# Altium project obc.PrjPCB
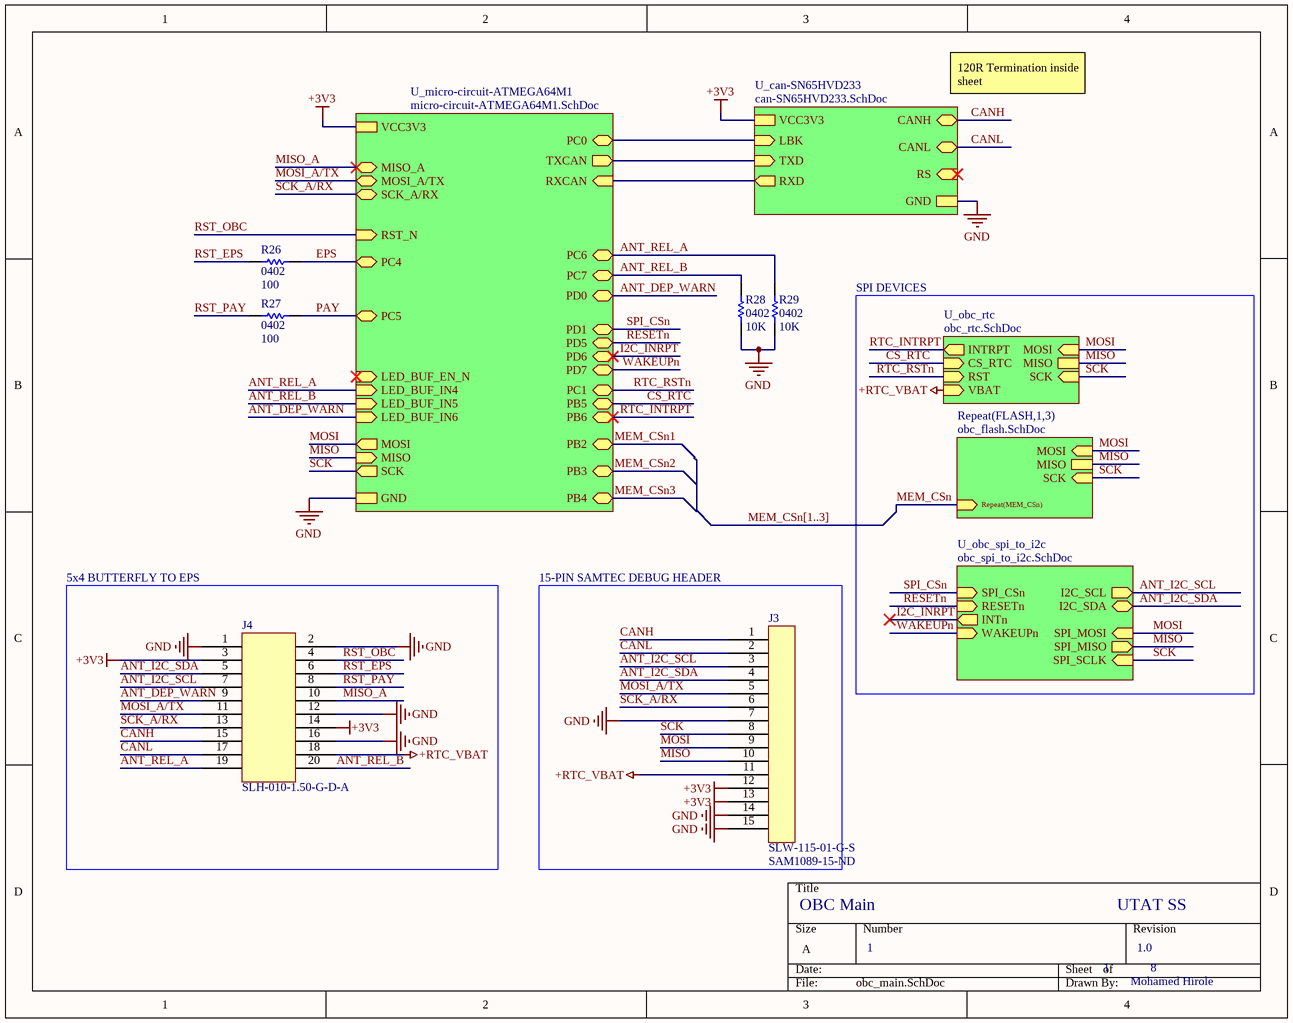
[diagram p0: obc_main.SchDoc]
4 sheets, 30 parts. Net scope: hierarchical (ports join the sheet entries above them; power ports are global).
Board file: obc.PcbDoc
Sheets:
  obc_main.SchDoc
    U_obc_rtc = obc_rtc.SchDoc
    FLASH1 = obc_flash.SchDoc
    FLASH2 = obc_flash.SchDoc
    FLASH3 = obc_flash.SchDoc
    U_obc_spi_to_i2c = obc_spi_to_i2c.SchDoc

## Sheet obc_main.SchDoc: OBC Main
size A; DrawnBy: Mohamed Hirole; Organization: UTAT SS; DocumentNumber: 1; Revision: 1.0; SheetNumber: 1; SheetTotal: 8

### Parts
J3  SLW-115-01-G-S  [SAM1089-15-ND]
J4  SLH-010-1.50-G-D-A  [SLH-010-1.50-G-D-A]
R26  0402  value 100  [RES0402R]
R27  0402  value 100  [RES0402R]
R28  0402  value 10K  [RES0402R]
R29  0402  value 10K  [RES0402R]

### Blocks framed on the sheet
5x4 BUTTERFLY TO EPS: J4
15-PIN SAMTEC DEBUG HEADER: J3

### Sub-sheets
Repeat(FLASH,1,3) = obc_flash.SchDoc: MOSI (in), SCK (in), MISO, Repeat(MEM_CSn) (in)
U_can-SN65HVD233 = can-SN65HVD233.SchDoc (file not in this document): RXD (out), TXD (in), LBK (in), CANL (bidir), CANH (bidir), VCC3V3, GND, RS (in)
U_micro-circuit-ATMEGA64M1 = micro-circuit-ATMEGA64M1.SchDoc (file not in this document): MISO (in), MOSI (out), SCK (out), TXCAN (out), RXCAN (in), MISO_A (bidir), MOSI_A/TX (bidir), SCK_A/RX (bidir), PB2 (bidir), PB3 (bidir), PB4 (bidir), PB5 (bidir), PB6 (bidir), PC0 (bidir), PD0 (bidir), PC1 (bidir), PC4 (bidir), PC5 (bidir), PC6 (bidir), PC7 (bidir), PD1 (bidir), PD5 (bidir), PD6 (bidir), PD7 (bidir), RST_N (in), LED_BUF_EN_N (in), VCC3V3, GND, LED_BUF_IN4 (in), LED_BUF_IN5 (in), LED_BUF_IN6 (in)
U_obc_rtc = obc_rtc.SchDoc: CS_RTC (in), MOSI (in), MISO, SCK (in), INTRPT (out), VBAT (in), RST (in)
U_obc_spi_to_i2c = obc_spi_to_i2c.SchDoc: SPI_MOSI (in), I2C_SDA (bidir), INTn (out), WAKEUPn (in), RESETn (in), SPI_MISO (out), SPI_CSn (in), SPI_SCLK (in), I2C_SCL (out)

### Nets
+3V3: J3.12 J3.13 J4.3 J4.14 ; sheet U_micro-circuit-ATMEGA64M1/VCC3V3, sheet U_can-SN65HVD233/VCC3V3
+RTC_VBAT: J3.11 J4.18 ; sheet U_obc_rtc/VBAT
GND: J3.7 J3.14 J3.15 J4.1 J4.2 J4.12 J4.16 R28.1 R29.1 ; sheet U_micro-circuit-ATMEGA64M1/GND, sheet U_can-SN65HVD233/GND
ANT_DEP_WARN: J4.9 ; sheet U_micro-circuit-ATMEGA64M1/PD0, sheet U_micro-circuit-ATMEGA64M1/LED_BUF_IN6
ANT_I2C_SCL: J3.3 J4.7 ; sheet U_obc_spi_to_i2c/I2C_SCL
ANT_I2C_SDA: J3.4 J4.5 ; sheet U_obc_spi_to_i2c/I2C_SDA
ANT_REL_A: J4.19 R29.2 ; sheet U_micro-circuit-ATMEGA64M1/PC6, sheet U_micro-circuit-ATMEGA64M1/LED_BUF_IN4
ANT_REL_B: J4.20 R28.2 ; sheet U_micro-circuit-ATMEGA64M1/PC7, sheet U_micro-circuit-ATMEGA64M1/LED_BUF_IN5
CANH: J3.1 J4.15 ; sheet U_can-SN65HVD233/CANH
CANL: J3.2 J4.17 ; sheet U_can-SN65HVD233/CANL
CS_RTC: sheet U_obc_rtc/CS_RTC, sheet U_micro-circuit-ATMEGA64M1/PB5
EPS: R26.2 ; sheet U_micro-circuit-ATMEGA64M1/PC4
I2C_INRPT: sheet U_micro-circuit-ATMEGA64M1/PD6, sheet U_obc_spi_to_i2c/INTn
MEM_CSn: sheet Repeat(FLASH,1,3)/Repeat(MEM_CSn)
MISO: J3.10 ; sheet U_obc_rtc/MISO, sheet Repeat(FLASH,1,3)/MISO, sheet U_micro-circuit-ATMEGA64M1/MISO, sheet U_obc_spi_to_i2c/SPI_MISO
MISO_A: J4.10 ; sheet U_micro-circuit-ATMEGA64M1/MISO_A
MOSI: J3.9 ; sheet U_obc_rtc/MOSI, sheet Repeat(FLASH,1,3)/MOSI, sheet U_micro-circuit-ATMEGA64M1/MOSI, sheet U_obc_spi_to_i2c/SPI_MOSI
MOSI_A/TX: J3.5 J4.11 ; sheet U_micro-circuit-ATMEGA64M1/MOSI_A/TX
PAY: R27.2 ; sheet U_micro-circuit-ATMEGA64M1/PC5
RESETn: sheet U_micro-circuit-ATMEGA64M1/PD5, sheet U_obc_spi_to_i2c/RESETn
RST_EPS: J4.6 R26.1
RST_OBC: J4.4 ; sheet U_micro-circuit-ATMEGA64M1/RST_N
RST_PAY: J4.8 R27.1
RTC_INTRPT: sheet U_obc_rtc/INTRPT, sheet U_micro-circuit-ATMEGA64M1/PB6
RTC_RSTn: sheet U_obc_rtc/RST, sheet U_micro-circuit-ATMEGA64M1/PC1
SCK: J3.8 ; sheet U_obc_rtc/SCK, sheet Repeat(FLASH,1,3)/SCK, sheet U_micro-circuit-ATMEGA64M1/SCK, sheet U_obc_spi_to_i2c/SPI_SCLK
SCK_A/RX: J3.6 J4.13 ; sheet U_micro-circuit-ATMEGA64M1/SCK_A/RX
SPI_CSn: sheet U_micro-circuit-ATMEGA64M1/PD1, sheet U_obc_spi_to_i2c/SPI_CSn
WAKEUPn: sheet U_micro-circuit-ATMEGA64M1/PD7, sheet U_obc_spi_to_i2c/WAKEUPn
(unnamed): sheet U_micro-circuit-ATMEGA64M1/TXCAN, sheet U_can-SN65HVD233/TXD
(unnamed): sheet U_micro-circuit-ATMEGA64M1/RXCAN, sheet U_can-SN65HVD233/RXD
(unnamed): sheet U_micro-circuit-ATMEGA64M1/PC0, sheet U_can-SN65HVD233/LBK

### Buses and harness runs
bus MEM_CSn[1..3]

### Notes on the sheet
- 120R Termination inside sheet
- SPI DEVICES

### Library data of the parts
J3 = SLW-115-01-G-S: 15 Position Receptacle Connector 0.100" (2.54mm) Through Hole Gold; Manufacturer: Samtec; Max Current Rating: 7.1A; Contact Resistance: 10mR; Number of Positions: 15; Max Voltage Rating (AC): 550V; Gender: Female; Supplier 1: Digi-Key; Manufacturer Part Number: SLW-115-01-G-S; Stock 1: 0; Pricing 1: 1=2.44, 10=2.214, 25=2.0784, 50=1.988, 100=1.8976, 250=1.71684, 500=1.5813 (USD); Mount: Through Hole; Contact Plating: Gold; Contact Material: Bronze; Color: Black; Housing Color: Black; Housing Material: Polyester; Min Operating Temperature: -55°C; Max Operating Temperature: 125°C; Number of Rows: 1; Packaging: Bulk; Connector Type: Receptacle; Termination: Solder; Number of Contacts: 15; Orientation: Straight; Voltage Rating (AC): 550V; Package Quantity: 1; Length: 38.1mm; Pitch: 2.54mm; Depth: 2.54mm; Width: 2.54mm; Radiation Hardening: No; Lead Free: Lead Free; ComponentLink1URL: http://suddendocs.samtec.com/prints/slw-1xx-01-x-x-mkt.pdf?src-supplier=Digi-Key; ComponentLink1Description: http://suddendocs.samtec.com/prints/slw-1xx-01-x-x-mkt.pdf?src-supplier=Digi-Key; Supplier Part Number 1: SAM1089-15-ND
J4 = SLH-010-1.50-G-D-A: 0.50 mm Razor Beam™ LP Ultra Low Profile Socket Strip, alignment pin option; Supplier 1: SLH-010-1.50-G-D-A; Supplier Part Number 1: Samtec; ComponentLink1Description: Product Page; ComponentLink1URL: https://www.samtec.com/products/slh-010-1.50-g-d-a
R26-R29 = RES0402: 0402 resistor

## Sheet obc_rtc.SchDoc: Real Time Clock
size A4; DrawnBy: Mohamed Hirole; Organization: UTAT SS; DocumentNumber: 3; Revision: 2.0; SheetNumber: 3; SheetTotal: 8
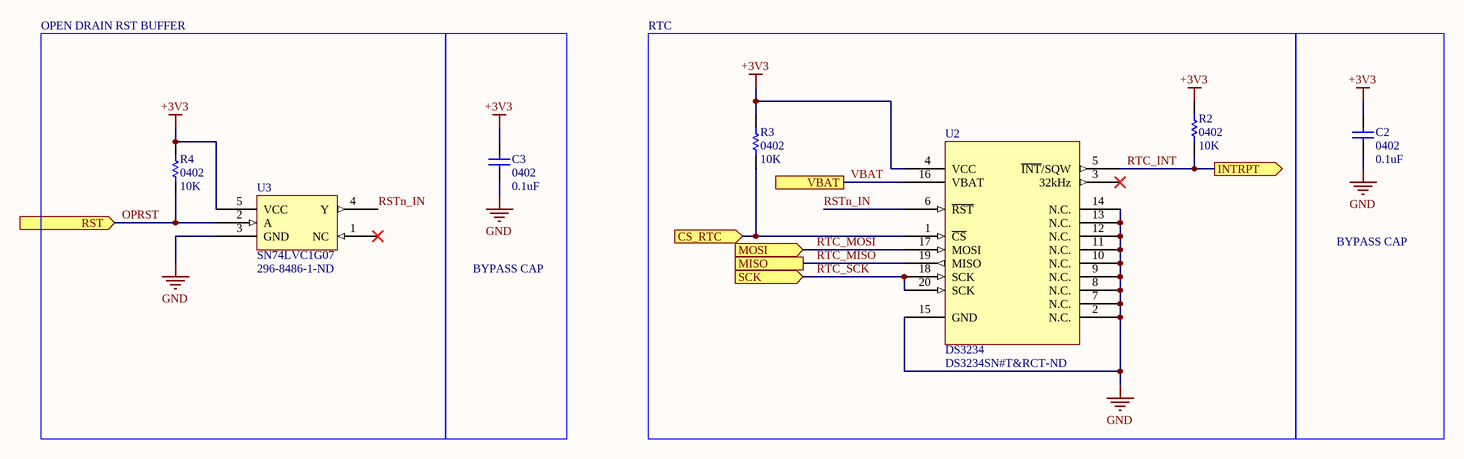
[diagram p1: obc_rtc.SchDoc]

### Parts
C2  0402  value 0.1uF  [CAP0402R]
C3  0402  value 0.1uF  [CAP0402R]
R2  0402  value 10K  [RES0402R]
R3  0402  value 10K  [RES0402R]
R4  0402  value 10K  [RES0402R]
U2  DS3234  Supplier Part Number 2: DS3234SN#T&RCT-ND  [SOIC127P1032X265-20]
U3  SN74LVC1G07  Supplier Part Number 1: 296-8486-1-ND  [SOT65P210X110-5N]

### Blocks framed on the sheet
OPEN DRAIN RST BUFFER: R4 U3
BYPASS CAP: C3
RTC: R2 R3 U2
BYPASS CAP: C2

### Ports
CS_RTC (in), INTRPT (out), MISO, MOSI (in), RST (in), SCK (in), VBAT

### Nets
+3V3: C2.2 C3.2 R2.2 R3.2 R4.2 U2.4(VCC) U3.5(VCC)
GND: C2.1 C3.1 U2.2(N.C.) U2.7(N.C.) U2.8(N.C.) U2.9(N.C.) U2.10(N.C.) U2.11(N.C.) U2.12(N.C.) U2.13(N.C.) U2.14(N.C.) U2.15(GND) U3.3(GND)
VBAT: U2.16(VBAT) ; port VBAT  [project net +RTC_VBAT]
CS_RTC: R3.1 U2.1(~{CS}) ; port CS_RTC
OPRST: R4.1 U3.2(A) ; port RST  [project net RTC_RSTn]
RSTn_IN: U2.6(~{RST}) U3.4(Y)
RTC_INT: R2.1 U2.5(~{INT}/SQW) ; port INTRPT  [project net RTC_INTRPT]
RTC_MISO: U2.19(MISO) ; port MISO  [project net MISO]
RTC_MOSI: U2.17(MOSI) ; port MOSI  [project net MOSI]
RTC_SCK: U2.18(SCK) U2.20(SCK) ; port SCK  [project net SCK]

Not connected (* = marked no-connect by the designer): U2 3(32kHz)*; U3 1(NC)*

### Library data of the parts
C2 C3 = CAP0402: 0402 capacitor
R2-R4 = RES0402: 0402 resistor
U2 = DS3234: SPI bus RTC with integrated crystal and SRAM; Supplier 1: Digi-Key; Supplier 2: Digi-Key
U3 = SN74LVC1G07: Single element non-inverting open drain buffer; Supplier 1: Digi-Key

## Sheet obc_flash.SchDoc: Flash Memory
size A4; DrawnBy: Mohamed Hirole; Organization: UTAT SS; DocumentNumber: 2; Revision: 2.0; SheetNumber: 2; SheetTotal: 8
Used 3 times, as channels FLASH1, FLASH2, FLASH3. Parts and nets are listed once, with the designators drawn on the sheet.
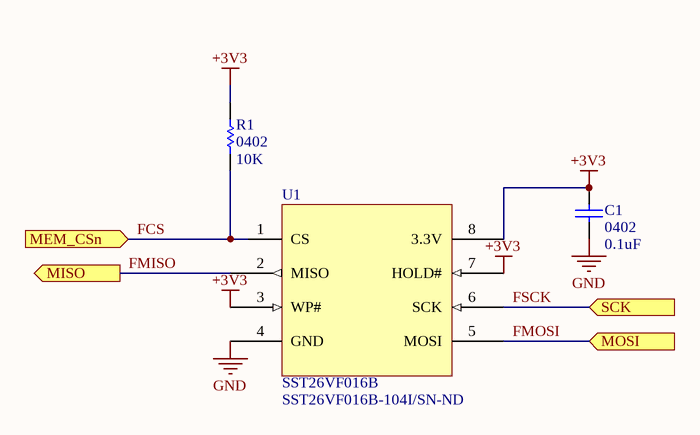
[diagram p2: obc_flash.SchDoc]

### Parts
C1  0402  value 0.1uF  [CAP0402R]
R1  0402  value 10K  [RES0402R]
U1  SST26VF016B  Supplier Part Number 1: SST26VF016B-104I/SN-ND  [SOIC127P500X600-8N]

### Ports
MEM_CSn (in), MISO (out), MOSI (in), SCK (in)

### Nets
+3V3: C1.1 R1.2 U1.3(WP#) U1.7(HOLD#) U1.8(3.3V)
GND: C1.2 U1.4(GND)
FCS: R1.1 U1.1(CS) ; port MEM_CSn
FMISO: U1.2(MISO) ; port MISO
FMOSI: U1.5(MOSI) ; port MOSI
FSCK: U1.6(SCK) ; port SCK

### Channels
FLASH1: designators end in _FLASH1; ports MEM_CSn=MEM_CSn1 MISO=MISO MOSI=MOSI SCK=SCK
FLASH2: designators end in _FLASH2; ports MEM_CSn=MEM_CSn2 MISO=MISO MOSI=MOSI SCK=SCK
FLASH3: designators end in _FLASH3; ports MEM_CSn=MEM_CSn3 MISO=MISO MOSI=MOSI SCK=SCK

### Library data of the parts
C1 = CAP0402: 0402 capacitor
R1 = RES0402: 0402 resistor
U1 = SST26VF016B: 2.5V/3.0V 16 Mbit Serial Quad I/O (SQI) Flash Memory; ComponentLink1Description: SST25VF016B; ComponentLink1URL: https://www.digikey.ca/product-detail/en/microchip-technology/SST26VF016B-104I-SN/SST26VF016B-104I-SN-ND/5033651; Supplier 1: Digi-Key

## Sheet obc_spi_to_i2c.SchDoc: SPI to I2C Bridge
size A4; DrawnBy: Mohamed Hirole; Organization: UTAT SS; DocumentNumber: 4; Revision: 1.0; SheetNumber: 4; SheetTotal: 8
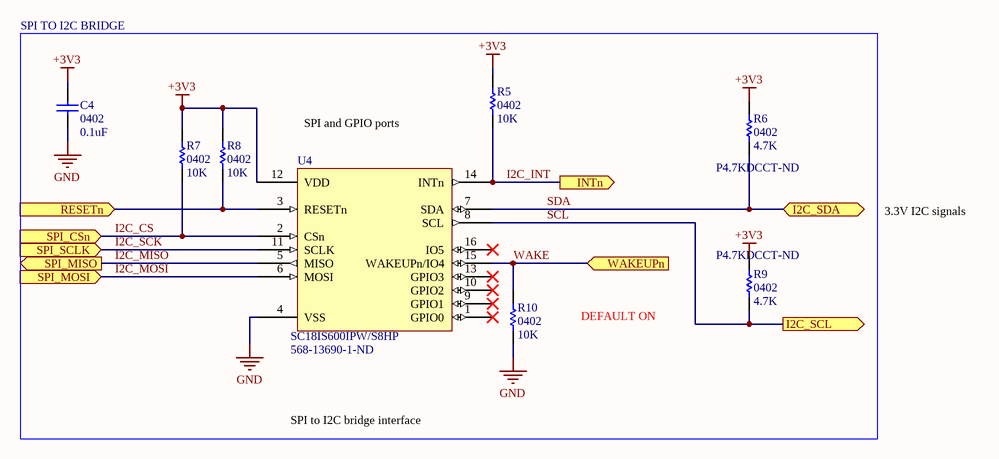
[diagram p3: obc_spi_to_i2c.SchDoc]

### Parts
C4  0402  value 0.1uF  [CAP0402R]
R5  0402  value 10K  [RES0402R]
R6  0402  value 4.7K  Supplier Part Number 1: P4.7KDCCT-ND  [RES0402R]
R7  0402  value 10K  [RES0402R]
R8  0402  value 10K  [RES0402R]
R9  0402  value 4.7K  Supplier Part Number 1: P4.7KDCCT-ND  [RES0402R]
R10  0402  value 10K  [RES0402R]
U4  SC18IS600IPW/S8HP  Supplier Part Number 1: 568-13690-1-ND  [TSOP65P640X110-16N]

### Ports
I2C_SCL (out), I2C_SDA (bidir), INTn (out), RESETn (in), SPI_CSn (in), SPI_MISO (out), SPI_MOSI (in), SPI_SCLK (in), WAKEUPn (in)

### Nets
+3V3: C4.2 R5.2 R6.2 R7.2 R8.2 R9.2 U4.12(VDD)
GND: C4.1 R10.1 U4.4(VSS)
I2C_CS: R7.1 U4.2(CSn) ; port SPI_CSn  [project net SPI_CSn]
I2C_INT: R5.1 U4.14(INTn) ; port INTn  [project net I2C_INRPT]
I2C_MISO: U4.5(MISO) ; port SPI_MISO  [project net MISO]
I2C_MOSI: U4.6(MOSI) ; port SPI_MOSI  [project net MOSI]
I2C_SCK: U4.11(SCLK) ; port SPI_SCLK  [project net SCK]
RESETn: R8.1 U4.3(RESETn) ; port RESETn
SCL: R9.1 U4.8(SCL) ; port I2C_SCL  [project net ANT_I2C_SCL]
SDA: R6.1 U4.7(SDA) ; port I2C_SDA  [project net ANT_I2C_SDA]
WAKE: R10.2 U4.15(WAKEUPn/IO4) ; port WAKEUPn  [project net WAKEUPn]

Not connected (* = marked no-connect by the designer): U4 1(GPIO0)* 9(GPIO1)* 10(GPIO2)* 13(GPIO3)* 16(IO5)*

### Notes on the sheet
- SPI TO I2C BRIDGE
- SPI and GPIO ports
- 3.3V I2C signals
- DEFAULT ON
- SPI to I2C bridge interface

### Library data of the parts
C4 = CAP0402: 0402 capacitor
R5 R7 R8 R10 = RES0402: 0402 resistor
R6 R9 = RES0402: 0402 resistor; Manufacturer: Panasonic; Manufacturer Part Number: ERA-2AEB472X; Description: METAL FILM RESISTOR, 4.7KOHM, 63mW,  0.1%; Product Range:AEC-Q200 ERA Series; Resistance:4.7kohm; Power Rating:63mW; Resistance Tolerance:  0.1%; Voltage Rating:25V; Resistor Case Style:0402 ^1005 Metric]; Packaging:Cut Tape; MSL:-; Resistance: 4.7kR; Power Rating: 63mW; Tolerance: 0.1%; Voltage Rating: 25V; Temperature Coefficient: 25ppm/°C; Supplier 1: Digi-Key; Stock 1: 199808; Pricing 1: 1=0.45, 10=0.321, 100=0.1283, 1000=0.06322, 2500=0.05858, 5000=0.053 (USD); Mount: Surface Mount; Case/Package: 0402; Number of Pins: 2; Case Code (Metric): 1005; Case Code (Imperial): 0402; Contact Plating: Tin; Min Operating Temperature: -55°C; Max Operating Temperature: 155°C; Packaging: Tape and Reel; Package Quantity: 1; Composition: Thin Film,Metal Film; Number of Terminations: 2; Military Standard: Not; Max Power Dissipation: 63mW; Voltage Rating (DC): 25V; Termination: SMD/SMT; Length: 1mm; Height: 0.35mm; Width: 0.02inch; Depth: 0.5mm; Radiation Hardening: No; REACH SVHC: No SVHC; Lead Free: Lead Free; ComponentLink1URL: http://www.farnell.com/datasheets/328837.pdf?src-supplier=Farnell; ComponentLink1Description: http://www.farnell.com/datasheets/328837.pdf?src-supplier=Farnell; ComponentLink2URL: http://www.mouser.com/ds/2/315/AOA0000C237-1100991.pdf?src-supplier=Mouser; ComponentLink2Description: http://www.mouser.com/ds/2/315/AOA0000C237-1100991.pdf?src-supplier=Mouser; ComponentLink3URL: http://www.farnell.com/datasheets/328837.pdf?src-supplier=Element14; ComponentLink3Description: http://www.farnell.com/datasheets/328837.pdf?src-supplier=Element14; ComponentLink4URL: http://www.farnell.com/datasheets/1776116.pdf?src-supplier=Element14; ComponentLink4Description: http://www.farnell.com/datasheets/1776116.pdf?src-supplier=Element14; ComponentLink5URL: http://industrial.panasonic.com/www-data/pdf/AOA0000/AOA0000CE26.pdf?src-supplier=Avnet; ComponentLink5Description: http://industrial.panasonic.com/www-data/pdf/AOA0000/AOA0000CE26.pdf?src-supplier=Avnet; ComponentLink6URL: https://www.alliedelec.com/m/d/b6b0537e86f421aa7f5975bb1d8f429a.pdf?src-supplier=Allied+Electronics; ComponentLink6Description: https://www.alliedelec.com/m/d/b6b0537e86f421aa7f5975bb1d8f429a.pdf?src-supplier=Allied+Electronics; ComponentLink7URL: http://uk.rs-online.com/webdocs/0bee/0900766b80beefcc.pdf?src-supplier=RSComponents; ComponentLink7Description: http://uk.rs-online.com/webdocs/0bee/0900766b80beefcc.pdf?src-supplier=RSComponents; ComponentLink8URL: http://industrial.panasonic.com/www-data/pdf/AOA0000/AOA0000CE26.pdf?src-supplier=Future+Electronics; ComponentLink8Description: http://industrial.panasonic.com/www-data/pdf/AOA0000/AOA0000CE26.pdf?src-supplier=Future+Electronics; ComponentLink9URL: http://www.farnell.com/datasheets/1776116.pdf?src-supplier=Farnell; ComponentLink9Description: http://www.farnell.com/datasheets/1776116.pdf?src-supplier=Farnell
U4 = SC18IS600IPW/S8HP: SPI to I2C bridge.; Supplier 1: Digikey

## Nets that join several sheets
+3V3: obc_main (J3.12 J3.13 J4.3 J4.14), obc_rtc (7 pins), FLASH1 (5 pins), FLASH2 (5 pins), FLASH3 (5 pins), obc_spi_to_i2c (7 pins)
+RTC_VBAT: obc_main (J3.11 J4.18), obc_rtc (U2.16)
GND: obc_main (9 pins), obc_rtc (13 pins), FLASH1 (C1_FLASH1.2 U1_FLASH1.4), FLASH2 (C1_FLASH2.2 U1_FLASH2.4), FLASH3 (C1_FLASH3.2 U1_FLASH3.4), obc_spi_to_i2c (C4.1 R10.1 U4.4)
ANT_I2C_SCL: obc_main (J3.3 J4.7), obc_spi_to_i2c (R9.1 U4.8)
ANT_I2C_SDA: obc_main (J3.4 J4.5), obc_spi_to_i2c (R6.1 U4.7)
MISO: obc_main (J3.10), obc_rtc (U2.19), FLASH1 (U1_FLASH1.2), FLASH2 (U1_FLASH2.2), FLASH3 (U1_FLASH3.2), obc_spi_to_i2c (U4.5)
MOSI: obc_main (J3.9), obc_rtc (U2.17), FLASH1 (U1_FLASH1.5), FLASH2 (U1_FLASH2.5), FLASH3 (U1_FLASH3.5), obc_spi_to_i2c (U4.6)
SCK: obc_main (J3.8), obc_rtc (U2.18 U2.20), FLASH1 (U1_FLASH1.6), FLASH2 (U1_FLASH2.6), FLASH3 (U1_FLASH3.6), obc_spi_to_i2c (U4.11)